# Altium schematic sheet GSM Antenna.SchDoc: GSM Antenna & Match Circuit
size 292 x 193 mm; SheetNumber: 13; SheetTotal: 15
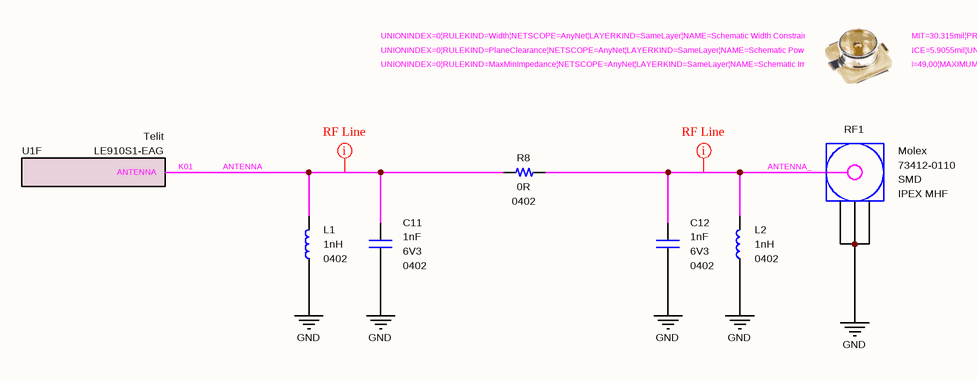
[diagram p0: GSM Antenna.SchDoc]

## Parts
C11  value 1nF  Case: 0402  Voltage: 6V3  [CAPACITOR_0402]
C12  value 1nF  Case: 0402  Voltage: 6V3  [CAPACITOR_0402]
L1  value 1nH  Case: 0402  [INDUCTOR_0402]
L2  value 1nH  Case: 0402  [INDUCTOR_0402]
R8  value 0R  Case: 0402  [RESISTOR_0402]
RF1  Connector Type: IPEX MHF  Case: SMD  Manufacturer Part Number: 73412-0110  Manufacturer Name: Molex  [Connector_IPEX]
U1  Manufacturer Part Number: LE910S1-EAG  Manufacturer Name: Telit  [LE910 GSM Modem]  (hidden comment: LE910S1-EAG LTE GSM Module)  (part F of 19)

## Nets
GND: C11.1 C12.1 L1.1 L2.1 RF1.2(GND) RF1.3(GND) RF1.4(GND)
ANTENNA: C11.2 L1.2 R8.2 U1.K01(ANTENNA)
ANTENNA_: C12.2 L2.2 R8.1 RF1.1(Signal)

## Layout directives
rule Impedance Constraint [Min = 49.00    Max = 50.00    ]; rule Power Plane Clearance [Clearance = 5.906mil]; rule Width Constraint [Pref Width = 0.77mm    Min Width = 0.77mm    Max Width = 0.77mm]: ANTENNA, ANTENNA_

## Notes on the sheet
- © 2021 All rights reserved.
  This document may not, in whole or in part, be copied, photocopied, reproduced, translated or converted to any electronic or machine readable from without prior written permission of Mehmet Günce Akkoyun.
  Engineer contact : akkoyun@me.com
- Property of
- Engineer :
- Date :
- Size :
- A4
- Time :
- Project :
- Page :
- /
- Customer :
- Product ID :
- Module ID :
- Version :
- File :
- Revision :

## Library data of the parts
C11 C12 = 1nF [0402-6V3]: Capacitor - 1nF [0402] (Ceramic); Manufacturer Name: AVX; Manufacturer Part Number: 04026C102MAT2A; Dielectric: X7R; Tolerance: 20%; Maximum Operating Temperature: +125; Minimum Operating Temperature: -55; Height: 0.25mm; ROHS: Yes; Weight: 0.65mg; ComponentLink1Description: DataSheet; ComponentLink1URL: https://www.mouser.com.tr/datasheet/2/40/X7RDielectric-777024.pdf
L1 L2 = 1nH [0402]: Fixed Inductor; Manufacturer Name: Murata Electronics; Manufacturer Part Number: LQG15HN1N0S02D; Tolerance: 0.3 nH; Height: 0.35mm; ComponentLink1Description: DataSheet; ComponentLink1URL: https://www.mouser.com.tr/datasheet/2/281/JELF243B-0009-1699631.pdf
R8 = 0R: Thick Film Resistors - SMD 1/16 W 0 Ohms; Manufacturer Name: Vishay; Manufacturer Part Number: CRCW04020000Z0ED; Height: 0.4mm; ComponentLink1Description: DataSheet; ComponentLink1URL: https://www.mouser.com.tr/datasheet/2/427/dcrcwe3-1762152.pdf; ComponentLink2Description: Mouser; ComponentLink2URL: https://www.mouser.com.tr/ProductDetail/Vishay-Dale/CRCW04020000Z0ED?qs=sGAEpiMZZMu61qfTUdNhG2DpbjADlD3GG34cJb50zyg%3D
RF1 = IPEX MHF Connector: MOLEX   73412-0110   RF COAXIAL, MICROCOAXIAL, JACK, 50OHM; ROHS: Yes; Product Type: RF Connectors; Impedance: 50 Ohm; System: Connector
U1 = IC - LE910S1-EAG: Telit LE910S1-EAG GPRS/GNSS Module; Case: BGA